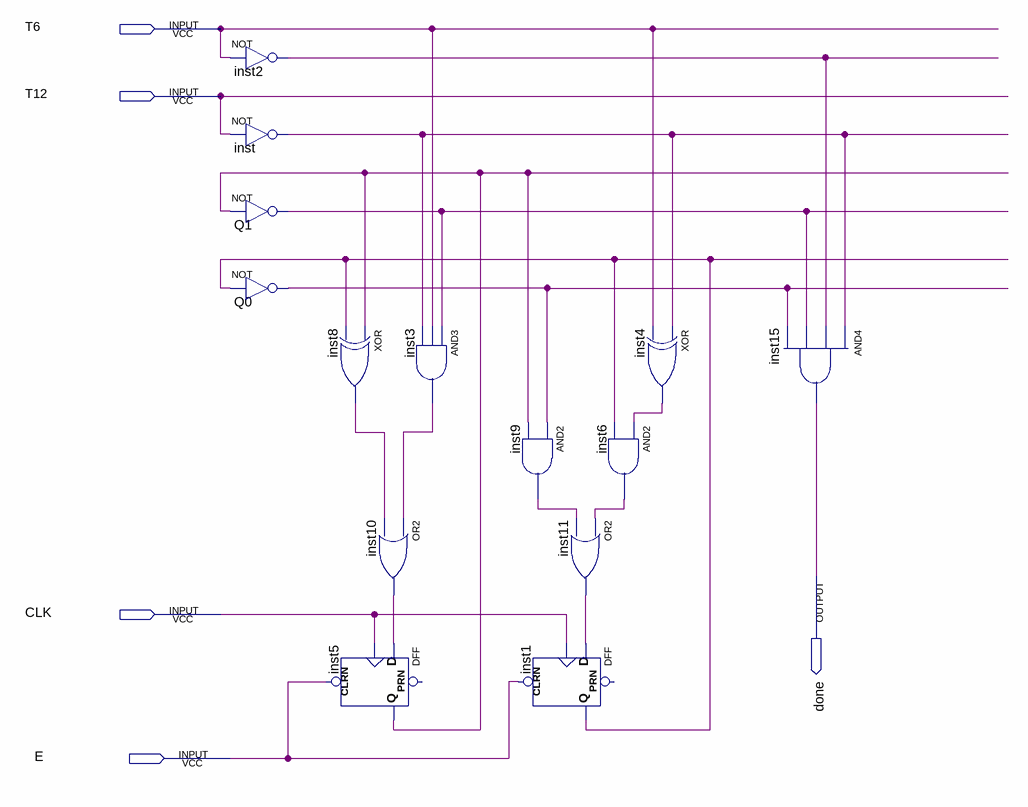
[diagram p0: schematic sheet]
// Quartus schematic timer.bdf as structural Verilog: 14 symbols, 5 pins
module timer (
  input  T6,
  input  T12,
  input  CLK,
  input  E,
  output done
);

  wire inst1_q, inst2_out, inst3_out, inst4_out, inst5_q, inst6_out, inst8_out, inst9_out, inst10_out,
       inst11_out, inst_out, Q0_out, Q1_out;

  not inst2 (inst2_out, T6);
  not inst (inst_out, T12);
  not Q1 (Q1_out, inst5_q);
  not Q0 (Q0_out, inst1_q);
  xor inst8 (inst8_out, inst5_q, inst1_q);
  DFF inst5 (.CLRN(E), .CLK(CLK), .D(inst10_out), .Q(inst5_q));  // open: PRN
  and inst3 (inst3_out, Q1_out, T6, inst_out);
  or inst10 (inst10_out, inst3_out, inst8_out);
  and inst9 (inst9_out, Q0_out, inst5_q);
  or inst11 (inst11_out, inst6_out, inst9_out);
  DFF inst1 (.CLRN(E), .CLK(CLK), .D(inst11_out), .Q(inst1_q));  // open: PRN
  xor inst4 (inst4_out, inst_out, T6);
  and inst6 (inst6_out, inst4_out, inst1_q);
  and inst15 (done, inst_out, inst2_out, Q1_out, Q0_out);
endmodule
